# Altium schematic sheet Quad-RS232-1.0-TTL.SchDoc: Quad UART - TTL
size A4; Revision: 1.0; SheetNumber: 4; SheetTotal: 4
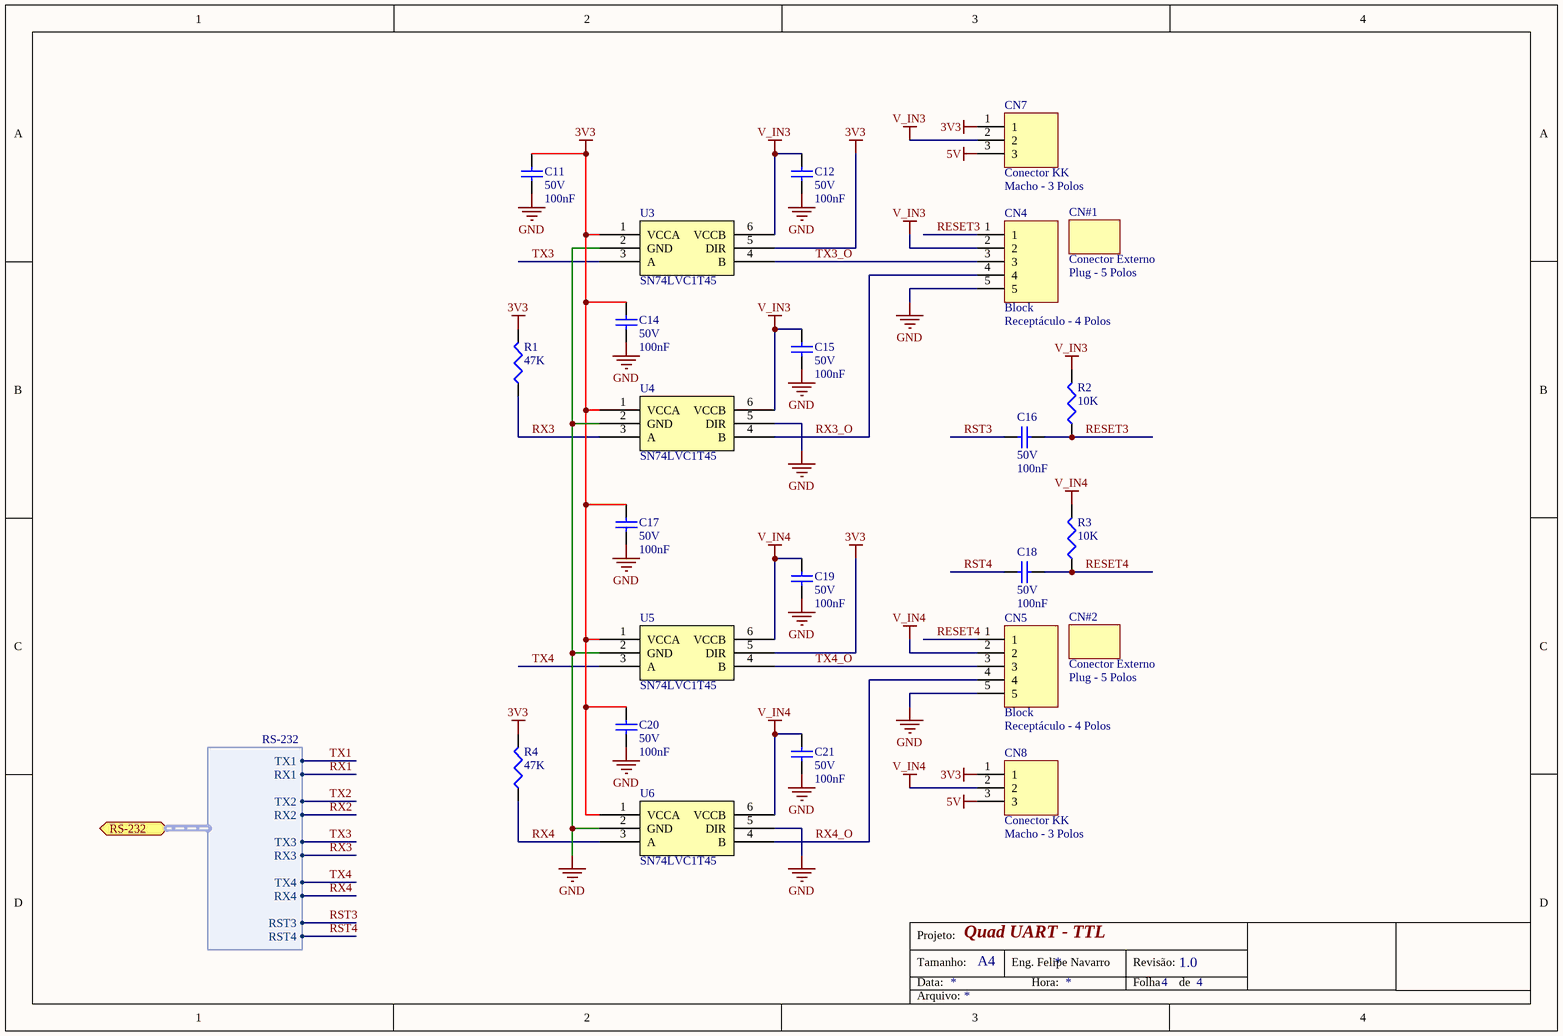
[diagram p0: Quad-RS232-1.0-TTL.SchDoc]

## Parts
C11  value 100nF  Tensão: 50V  [CC0603]  (hidden comment: Capacitor Cerâmico)
C12  value 100nF  Tensão: 50V  [CC0603]  (hidden comment: Capacitor Cerâmico)
C14  value 100nF  Tensão: 50V  [CC0603]  (hidden comment: Capacitor Cerâmico)
C15  value 100nF  Tensão: 50V  [CC0603]  (hidden comment: Capacitor Cerâmico)
C16  value 100nF  Tensão: 50V  [CC0603]  (hidden comment: Capacitor Cerâmico)
C17  value 100nF  Tensão: 50V  [CC0603]  (hidden comment: Capacitor Cerâmico)
C18  value 100nF  Tensão: 50V  [CC0603]  (hidden comment: Capacitor Cerâmico)
C19  value 100nF  Tensão: 50V  [CC0603]  (hidden comment: Capacitor Cerâmico)
C20  value 100nF  Tensão: 50V  [CC0603]  (hidden comment: Capacitor Cerâmico)
C21  value 100nF  Tensão: 50V  [CC0603]  (hidden comment: Capacitor Cerâmico)
CN4  Block  value Receptáculo - 4 Polos  [CONN BLOCK5 RCPT/H 3.81]
CN5  Block  value Receptáculo - 4 Polos  [CONN BLOCK5 RCPT/H 3.81]
CN7  Conector KK  value Macho - 3 Polos  [CONN HDR3-POL P.100 - H]
CN8  Conector KK  value Macho - 3 Polos  [CONN HDR3-POL P.100 - H]
CN#1  Conector Externo  value Plug - 5 Polos  [N/A]
CN#2  Conector Externo  value Plug - 5 Polos  [N/A]
R1  value 47K  [CC0603]  (hidden comment: Resistor)
R2  value 10K  [CC0603]  (hidden comment: Resistor)
R3  value 10K  [CC0603]  (hidden comment: Resistor)
R4  value 47K  [CC0603]  (hidden comment: Resistor)
U3  SN74LVC1T45  [SOT-23-6N]
U4  SN74LVC1T45  [SOT-23-6N]
U5  SN74LVC1T45  [SOT-23-6N]
U6  SN74LVC1T45  [SOT-23-6N]

## Ports
RS-232 (harness RS-232)

## Harnesses
RS-232: TX1, RX1, TX2, RX2, TX3, RX3, TX4, RX4, RST3, RST4

## Nets
3V3: C11.2 C14.2 C17.2 C20.2 CN7.1 CN8.1 R1.2 R4.2 U3.1(VCCA) U3.5(DIR) U4.1(VCCA) U5.1(VCCA) U5.5(DIR) U6.1(VCCA)
5V: CN7.3 CN8.3
GND: C11.1 C12.1 C14.1 C15.1 C17.1 C19.1 C20.1 C21.1 CN4.5 CN5.5 U3.2(GND) U4.2(GND) U4.5(DIR) U5.2(GND) U6.2(GND) U6.5(DIR)
V_IN3: C12.2 C15.2 CN4.2 CN7.2 R2.2 U3.6(VCCB) U4.6(VCCB)
V_IN4: C19.2 C21.2 CN5.2 CN8.2 R3.2 U5.6(VCCB) U6.6(VCCB)
RESET3: C16.2 CN4.1 R2.1
RESET4: C18.2 CN5.1 R3.1
RST3: C16.1 ; port RS-232.RST3
RST4: C18.1 ; port RS-232.RST4
RX1: port RS-232.RX1
RX2: port RS-232.RX2
RX3: R1.1 U4.3(A) ; port RS-232.RX3
RX3_O: CN4.4 U4.4(B)
RX4: R4.1 U6.3(A) ; port RS-232.RX4
RX4_O: CN5.4 U6.4(B)
TX1: port RS-232.TX1
TX2: port RS-232.TX2
TX3: U3.3(A) ; port RS-232.TX3
TX3_O: CN4.3 U3.4(B)
TX4: U5.3(A) ; port RS-232.TX4
TX4_O: CN5.3 U5.4(B)

## Notes on the sheet
- Projeto:
- Tamanho:
- Data:
- A4
- Eng. Felipe Navarro
- Hora:
- Revisão:
- Folha
- de
- Arquivo:

## Library data of the parts
C11 C12 C14-C21 = Cap 100nF 50V 0603 X7R: Capacitor (Semiconductor SIM Model); Chinês: Local; ChinesePrice: 0,00250; Corrente: *A; Potência: *W; Obs:: X7R; Tolerância: ±10%; Supplier 1: Digi-Key; Supplier Part Number 1: 1276-1000-1-ND; ComponentLink1Description: Datasheet; ComponentLink1URL: D:\Tecnoclade\Datasheet\!DataMissing.pdf
CN4 CN5 = SHRD Block 5P RCPT-H P3.81mm: Conector Shrouded Block; ChinesePrice: 0,00000; Chinês: ----; Corrente: 10A; Tensão: 300V; Potência: *; Supplier 1: Digi-Key; Supplier Part Number 1: ED2811-ND; Obs:: *; Tolerância: *; ComponentLink1Description: Datasheet; ComponentLink1URL: D:\Tecnoclade\Datasheet\!DataMissing.pdf
CN7 CN8 = KK 3P Macho-H P2.54mm: ChinesePrice: 0,00000; Chinês: ----; Corrente: *; Potência: *; Supplier 1: Digi-Key; Supplier Part Number 1: A19451-ND; Tensão: *; Obs:: *; Tolerância: *; ComponentLink1Description: Datasheet; ComponentLink1URL: D:\Tecnoclade\Datasheet\!DataMissing.pdf
CN#1 CN#2 = Plug Block 5P 3.81mm: Conector Plug; Chinês: ----; ChinesePrice: 0,00000; Corrente: *; Tensão: *; Supplier 1: Digi-Key; Supplier Part Number 1: ED2878-ND; Potência: *; Obs:: *; Tolerância: *; ComponentLink1Description: Datasheet; ComponentLink1URL: D:\Tecnoclade\Datasheet\!DataMissing.pdf
R1 R4 = Res 47K 1% 0603 1/10W: ChinesePrice: 0,00089; Chinês: Local; Corrente: *A; Potência: 1/10W; Tensão: *V; Obs: ±100ppm/ºC; Tolerância: ±1%; Supplier 1: Digi-Key; Supplier Part Number 1: RMCF0603FT47K0CT-ND; ComponentLink1Description: Datasheet; ComponentLink1URL: D:\Tecnoclade\Datasheet\!DataMissing.pdf
R2 R3 = Res 10K 1% 0603 1/10W: ChinesePrice: 0,00089; Chinês: Local; Corrente: *A; Potência: 1/10W; Tensão: *V; Tolerância: ±1%; Supplier 1: Digi-Key; Supplier Part Number 1: P10.0KHCT-ND; Obs: *; ComponentLink1Description: Datasheet; ComponentLink1URL: D:\Tecnoclade\Datasheet\!DataMissing.pdf
U3-U6 = SN74LVC1T45: SINGLE-BIT DUAL-SUPPLY BUS TRANSCEIVER  WITH CONFIGURABLE VOLTAGE TRANSLATION AND 3-STATE OUTPUTS; ChinesePrice: 0,00000; Chinês: ----; Corrente: *; Potência: *; Supplier 1: Digi-Key; Supplier Part Number 1: 296-16843-1-ND; Tensão: *; Value: *; Obs:: *; Tolerância: *; ComponentLink1Description: Datasheet; ComponentLink1URL: D:\Tecnoclade\Datasheet\